# Altium schematic sheet BMS_FETs.SchDoc
size Tabloid; SheetNumber: 2; SheetTotal: 3
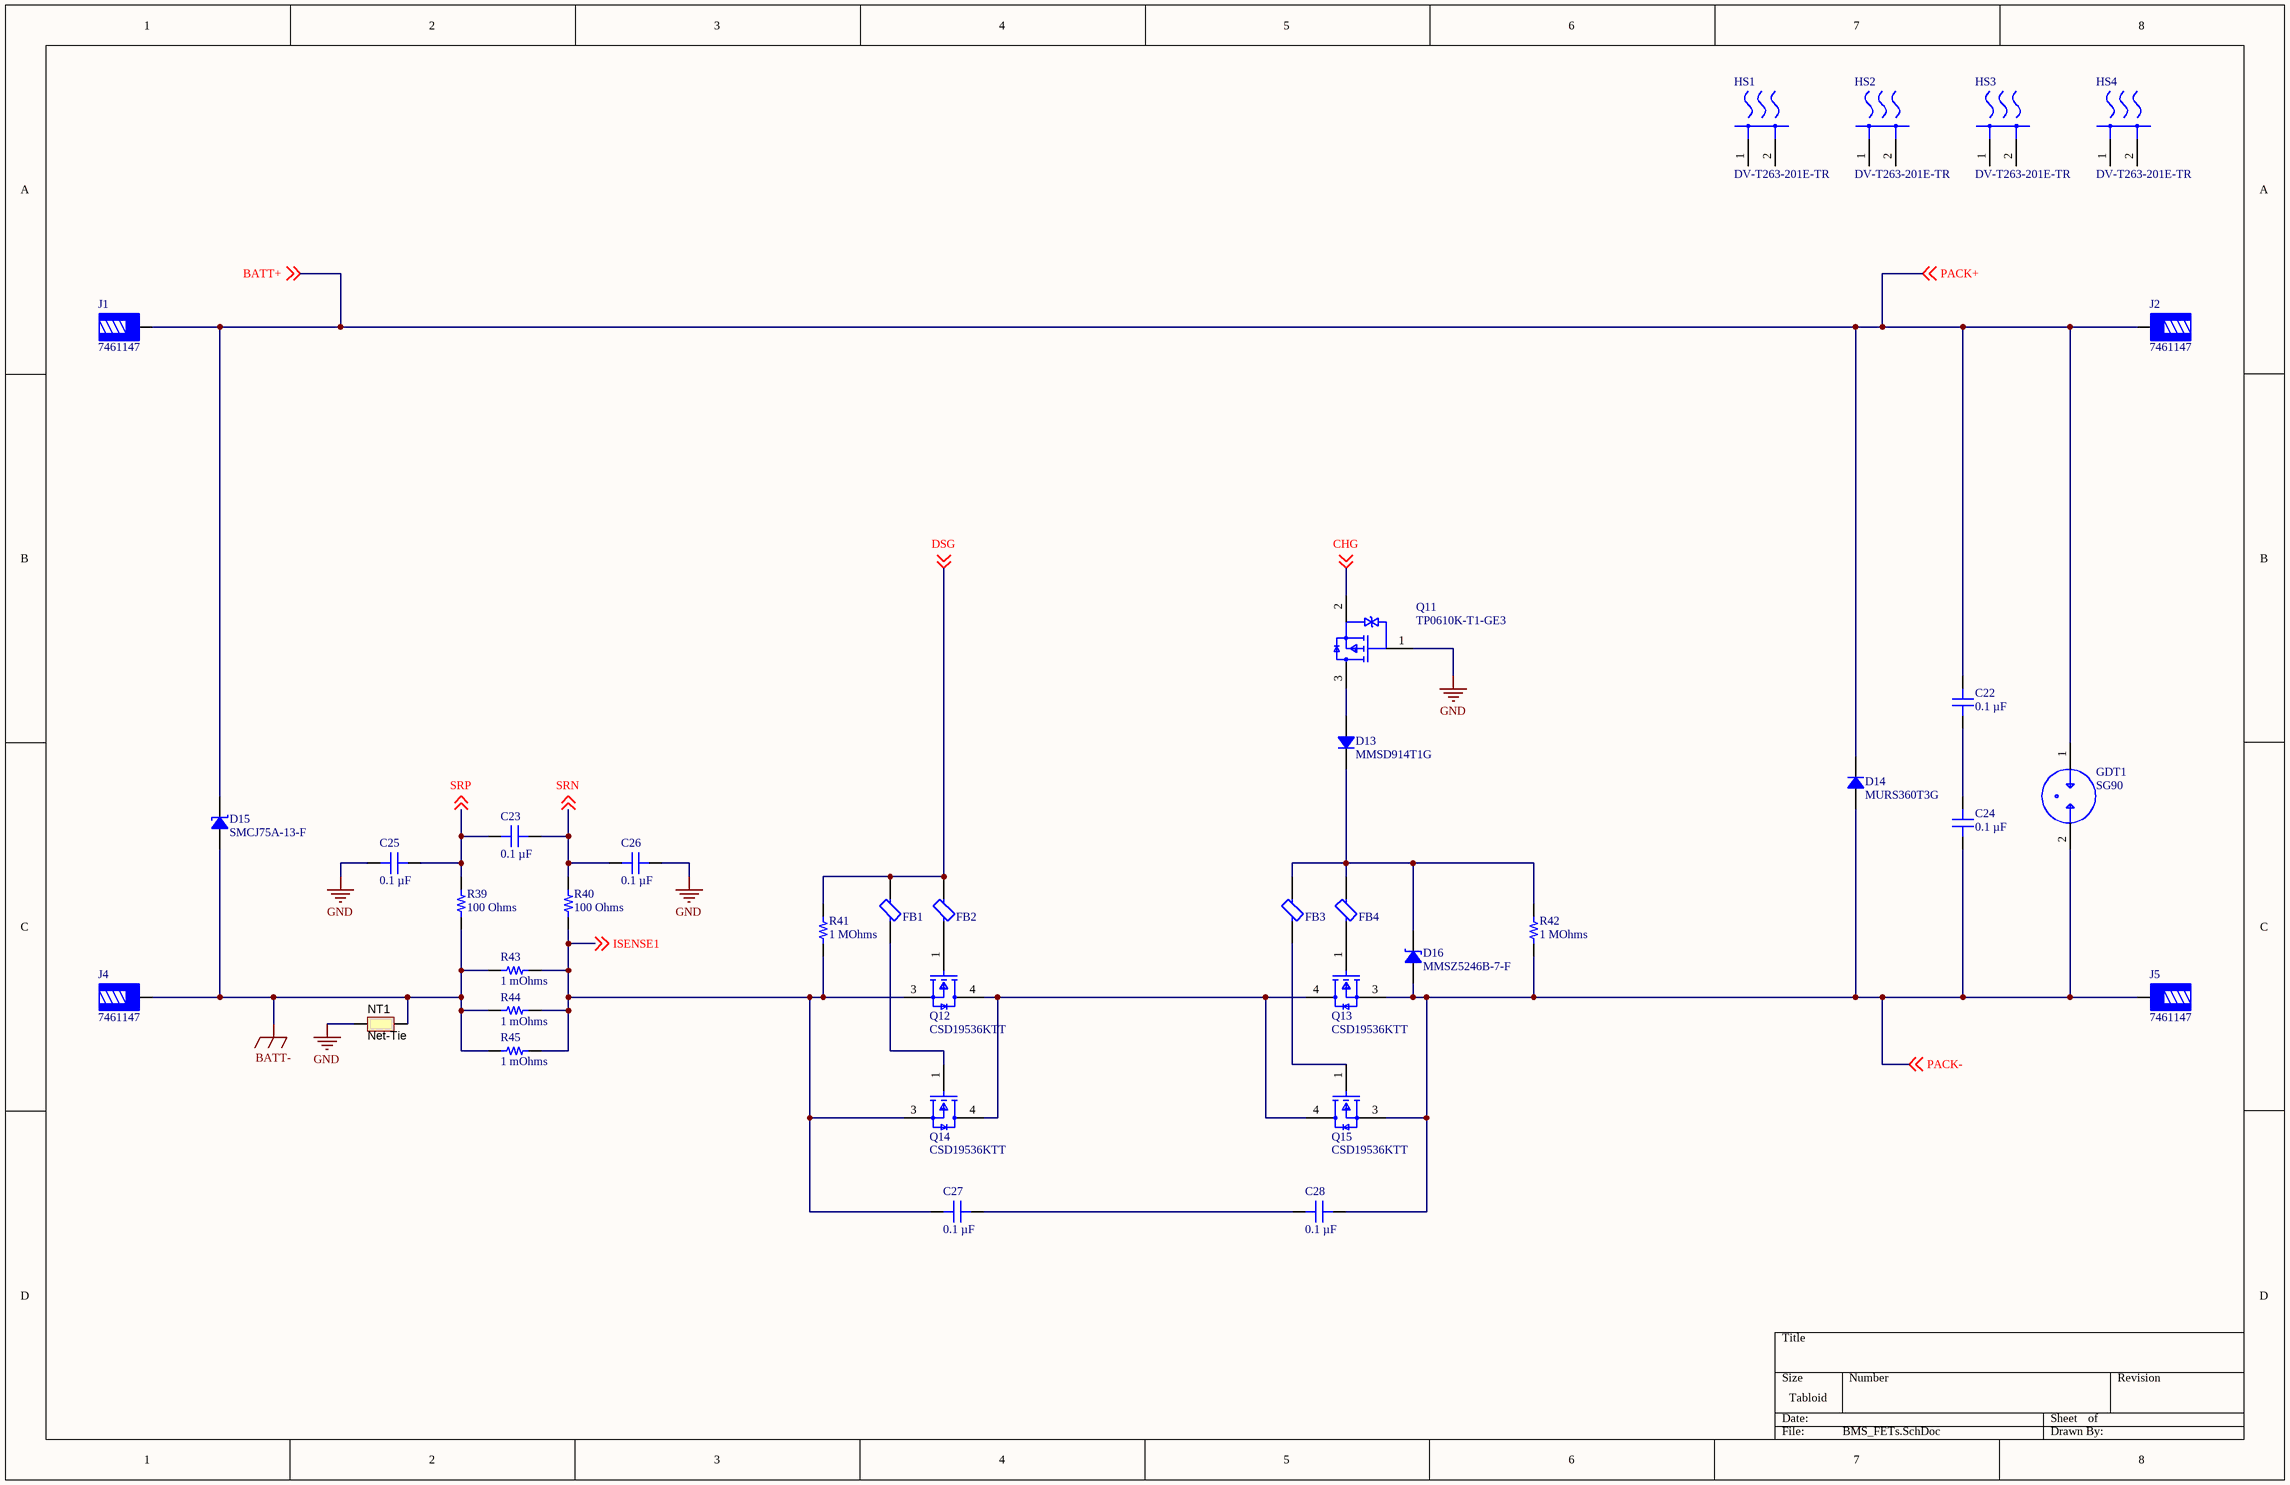
[diagram p0: BMS_FETs.SchDoc]

## Parts
C22  0.1 µF  [MURATA GRM188 0603_1608]
C23  0.1 µF  [CAP 0603_1608]
C24  0.1 µF  [MURATA GRM188 0603_1608]
C25  0.1 µF  [CAP 0603_1608]
C26  0.1 µF  [CAP 0603_1608]
C27  0.1 µF  [CAP 1206_3216 - 0.8MM]
C28  0.1 µF  [CAP 1206_3216 - 0.8MM]
D13  MMSD914T1G  [SOD-123]
D14  MURS360T3G  [DO214AB SMC]
D15  SMCJ75A-13-F  [DO214AB SMC]
D16  MMSZ5246B-7-F  [SOD-123]
FB1  BLM18SG221TN1D  [FP-BLM18-0_15-t0_5-IPC_C]  (value not drawn)
FB2  BLM18SG221TN1D  [FP-BLM18-0_15-t0_5-IPC_C]  (value not drawn)
FB3  BLM18SG221TN1D  [FP-BLM18-0_15-t0_5-IPC_C]  (value not drawn)
FB4  BLM18SG221TN1D  [FP-BLM18-0_15-t0_5-IPC_C]  (value not drawn)
GDT1  SG90  [FP-SG-MFG]
HS1  DV-T263-201E-TR  [FP-DV-T263-201E-TR-MFG]
HS2  DV-T263-201E-TR  [FP-DV-T263-201E-TR-MFG]
HS3  DV-T263-201E-TR  [FP-DV-T263-201E-TR-MFG]
HS4  DV-T263-201E-TR  [FP-DV-T263-201E-TR-MFG]
J1  7461147  [7461147_chemical surface]
J2  7461147  [7461147_chemical surface]
J4  7461147  [7461147_chemical surface]
J5  7461147  [7461147_chemical surface]
NT1  Net-Tie  [Net-Tie_10mil]  (net tie, no BOM)
Q11  TP0610K-T1-GE3  [FP-S-03946-IPC_C]
Q12  CSD19536KTT  [FP-CSD19536KTT-MFG]
Q13  CSD19536KTT  [FP-CSD19536KTT-MFG]
Q14  CSD19536KTT  [FP-CSD19536KTT-MFG]
Q15  CSD19536KTT  [FP-CSD19536KTT-MFG]
R39  100 Ohms  [RES 0805_2012]
R40  100 Ohms  [RES 0805_2012]
R41  1 MOhms  [RES 0603_1608]
R42  1 MOhms  [RES 0603_1608]
R43  1 mOhms  [RES 2512_6432]
R44  1 mOhms  [RES 2512_6432]
R45  1 mOhms  [RES 2512_6432]

## Nets
BATT-: D15.1 J4.1 NT1.2 R39.1 R43.1 R44.1 R45.1
GND: C25.1 C26.2 NT1.1 Q11.1(G)
BATT+: C22.2 D14.2 D15.2 GDT1.1 J1.1 J2.1 ; off-sheet BATT+, off-sheet PACK+  [also labelled PACK+]
CHG: Q11.2(S) ; off-sheet CHG
DSG: FB1.2 FB2.2 R41.2 ; off-sheet DSG
ISENSE1: C27.1 Q12.3(Source) Q14.3(Source) R40.1 R41.1 R43.2 R44.2 R45.2 ; off-sheet ISENSE1
PACK-: C24.1 C28.2 D14.1 D16.1 GDT1.2 J5.1 Q13.3(Source) Q15.3(Source) R42.1 ; off-sheet PACK-
SRN: C23.2 C26.1 R40.2 ; off-sheet SRN
SRP: C23.1 C25.2 R39.2 ; off-sheet SRP
NetC22_1: C22.1 C24.2
NetC27_2: C27.2 C28.1
NetD13_1: D13.1 Q11.3(D)
NetD13_2: D13.2 D16.2 FB3.2 FB4.2 R42.2
NetFB1_1: FB1.1 Q14.1(Gate)
NetFB2_1: FB2.1 Q12.1(Gate)
NetFB3_1: FB3.1 Q15.1(Gate)
NetFB4_1: FB4.1 Q13.1(Gate)
NetQ12_4: Q12.4(Drain) Q13.4(Drain) Q14.4(Drain) Q15.4(Drain)

Not connected (* = marked no-connect by the designer): HS1 1(MNT_1) 2(MNT_2); HS2 1(MNT_1) 2(MNT_2); HS3 1(MNT_1) 2(MNT_2); HS4 1(MNT_1) 2(MNT_2)

## Library data of the parts
C22 C24 = GRM188R72A104KA35D: CAP CER 0.1UF 100V X7R 0603; manufacturer: Murata Electronics; Tolerance: ±10%; Part Number: GRM188R72A104KA35D; Capacitance: 0.1 µF; Applications: General Purpose; componentlink1description: Datasheet; componentlink1url: https://www.murata.com/~/media/webrenewal/support/library/catalog/products/capacitor/mlcc/c02e.ashx?la=en-us; componentlink2description: DigiKey Link; componentlink2url: https://www.digikey.com/en/products/detail/murata-electronics/GRM188R72A104KA35D/702549; Device Package: 0603 (1608 Metric); lastupdated: 7/20/2024 12:23:21 AM; Lifecycle Status: Active; Minimum Order: 1; Mounting Type: Surface Mount, MLCC; Operating Temperature: -55°C ~ 125°C; Package / Case: 0603 (1608 Metric); packaging: TapeAndReel; partid: 9563; Part Status: Active; price: 0.02; series: GRM; Size / Dimension: 0.063" L x 0.031" W (1.60mm x 0.80mm); Supplier 1: DigiKey; Supplier Part Number 1: 490-3285-1-ND; Temperature Coefficient: X7R; Thickness (Max): 0.035" (0.90mm); value: 0.1 µF; Voltage - Rated: 100V
C23 C25 C26 = 885012206095: CAP CER 0.1UF 50V X7R 0603; manufacturer: Würth Elektronik; Tolerance: ±10%; Part Number: 885012206095; Capacitance: 0.1 µF; Applications: General Purpose; componentlink1description: Datasheet; componentlink1url: https://katalog.we-online.de/pbs/datasheet/885012206095.pdf; componentlink2description: DigiKey Link; componentlink2url: https://www.digikey.com/en/products/detail/würth-elektronik/885012206095/5453868; Device Package: 0603 (1608 Metric); lastupdated: 2/9/2024 8:10:15 PM; Lifecycle Status: Active; Minimum Order: 1; Mounting Type: Surface Mount, MLCC; Operating Temperature: -55°C ~ 125°C; Package / Case: 0603 (1608 Metric); packaging: TapeAndReel; partid: 14053; Part Status: Active; price: 0.02; series: WCAP-CSGP; Size / Dimension: 0.063" L x 0.031" W (1.60mm x 0.80mm); Supplier 1: DigiKey; Supplier Part Number 1: 732-8013-1-ND; Temperature Coefficient: X7R; Thickness (Max): 0.037" (0.95mm); value: 0.1 µF; Voltage - Rated: 50V
C27 C28 = 885342208002: CAP CER 0.1UF 200V X7R 1206; manufacturer: Würth Elektronik; Tolerance: ±10%; Part Number: 885342208002; Capacitance: 0.1 µF; Applications: General Purpose; componentlink1description: Datasheet; componentlink1url: https://katalog.we-online.de/pbs/datasheet/885342208002.pdf; componentlink2description: DigiKey Link; componentlink2url: https://www.digikey.com/en/products/detail/würth-elektronik/885342208002/9345893; Device Package: 1206 (3216 Metric); lastupdated: 6/4/2024 7:10:36 PM; Lifecycle Status: Active; Minimum Order: 1; Mounting Type: Surface Mount, MLCC; Operating Temperature: -55°C ~ 125°C; Package / Case: 1206 (3216 Metric); packaging: TapeAndReel; partid: 21012; Part Status: Active; price: 0.10; series: WCAP-CSMH; Size / Dimension: 0.126" L x 0.063" W (3.20mm x 1.60mm); Supplier 1: DigiKey; Supplier Part Number 1: 732-12081-1-ND; Temperature Coefficient: X7R; Thickness (Max): 0.071" (1.80mm); value: 0.1 µF; Voltage - Rated: 200V
D13 = MMSD914T1G: DIODE GEN PURP 100V 200MA SOD123; Manufacturer: ON Semiconductor; Current - Average Rectified (Io): 200mA (DC); Current - Reverse Leakage @ Vr: 5µA @ 75V; Diode Type: Standard; Reverse Recovery Time (trr): 4ns; Speed: Small Signal =< 200mA (Io), Any Speed; Voltage - Forward (Vf) (Max) @ If: 1V @ 10mA; Part Number: MMSD914T1G; ComponentLink1Description: Datasheet; ComponentLink1URL: http://www.onsemi.com/pub/Collateral/MMSD914T1-D.PDF; ComponentLink2Description: DigiKey Link; ComponentLink2URL: http://digikey.com/product-detail/en/on-semiconductor/MMSD914T1G/MMSD914T1GOSCT-ND/1139868; LastUpdated: 6/3/2024 7:54:45 PM; Lifecycle Status: Active; Minimum Order: 1; Mounting Type: Surface Mount; Operating Temperature - Junction: -55°C ~ 150°C; Package / Case: SOD-123; Packaging: TapeAndReel; PartId: 1020; Part Status: Active; Price: 0.03; Series: -; Supplier 1: DigiKey; Supplier Part Number 1: MMSD914T1GOSCT-ND; Supplier Device Package: SOD-123; Voltage - DC Reverse (Vr) (Max): 100V
D14 = MURS360T3G: DIODE GEN PURP 600V 3A SMC; Manufacturer: ON Semiconductor; Current - Reverse Leakage @ Vr: 10µA @ 600V; Diode Type: Standard; Reverse Recovery Time (trr): 75ns; Speed: Fast Recovery =< 500ns, > 200mA (Io); Voltage - Forward (Vf) (Max) @ If: 1.25V @ 3A; Part Number: MURS360T3G; ComponentLink1Description: Datasheet; ComponentLink1URL: http://www.onsemi.com/pub/Collateral/MURS320T3-D.PDF; ComponentLink2Description: DigiKey Link; ComponentLink2URL: http://digikey.com/product-detail/en/on-semiconductor/MURS360T3G/MURS360T3GOSCT-ND/964580; Current - Average Rectified (Io): 3A; LastUpdated: 6/3/2024 7:54:13 PM; Lifecycle Status: Active; Minimum Order: 1; Mounting Type: Surface Mount; Operating Temperature - Junction: -65°C ~ 175°C; Package / Case: DO-214AB, SMC; Packaging: TapeAndReel; PartId: 485; Part Status: Active; Price: 0.16; Series: -; Supplier 1: DigiKey; Supplier Part Number 1: MURS360T3GOSCT-ND; Supplier Device Package: SMC; Voltage - DC Reverse (Vr) (Max): 600V
D15 = SMCJ75A-13-F: TVS DIODE 75VWM 121VC SMC; Manufacturer: Diodes Incorporated; Current - Peak Pulse (10/1000µs): 12.4A; Power Line Protection: No; Power - Peak Pulse: 1500W (1.5kW); Type: Zener; Unidirectional Channels: 1; Voltage - Breakdown (Min): 83.3V; Voltage - Clamping (Max) @ Ipp: 121V; Voltage - Reverse Standoff (Typ): 75V; Part Number: SMCJ75A-13-F; Applications: General Purpose; ComponentLink1Description: Datasheet; ComponentLink1URL: https://www.diodes.com/assets/Datasheets/ds19003.pdf; ComponentLink2Description: DigiKey Link; ComponentLink2URL: https://www.digikey.com/en/products/detail/diodes-incorporated/SMCJ75A-13-F/765441; LastUpdated: 6/3/2024 7:57:03 PM; Lifecycle Status: Active; Minimum Order: 1; Mounting Type: Surface Mount; Operating Temperature: -55°C ~ 150°C (TJ); Package / Case: DO-214AB, SMC; Packaging: TapeAndReel; PartId: 6503; Part Status: Active; Price: 0.23; Series: -; Supplier 1: DigiKey; Supplier Part Number 1: SMCJ75A-FDICT-ND; Supplier Device Package: SMC
D16 = MMSZ5246B-7-F: DIODE ZENER 16V 500MW SOD123; Manufacturer: Diodes Incorporated; Current - Reverse Leakage @ Vr: 100 nA @ 12 V; Impedance (Max) (Zzt): 17 Ohms; Tolerance: ±5%; Voltage - Forward (Vf) (Max) @ If: 900 mV @ 10 mA; Part Number: MMSZ5246B-7-F; ComponentLink1Description: Datasheet; ComponentLink1URL: https://www.diodes.com/assets/Datasheets/ds18010.pdf; ComponentLink2Description: DigiKey Link; ComponentLink2URL: https://www.digikey.com/en/products/detail/diodes-incorporated/MMSZ5246B-7-F/717793; LastUpdated: 6/3/2024 7:55:47 PM; Lifecycle Status: Active; Minimum Order: 1; Mounting Type: Surface Mount; Operating Temperature: -65°C ~ 150°C; Package / Case: SOD-123; Packaging: TapeAndReel; PartId: 1896; Part Status: Active; Power - Max: 500 mW; Price: 0.02; Series: -; Supplier 1: DigiKey; Supplier Part Number 1: MMSZ5246B-FDICT-ND; Supplier Device Package: SOD-123; Voltage - Zener (Nom) (Vz): 16 V
FB1-FB4 = BLM18SG221TN1D: Chip Ferrite Bead, 0603, 220Ω @ 100MHz, 25%, 0.04Ω, 2.5A; Impedance: 220R; DC Resistance-Max: 40mR; Number of Circuits: 1; Test Frequency: 100MHz; Material: Ferrite; Lead Free: Lead Free; Width: 0.8mm; Max Current Rating: 2.5A; Termination: SMD/SMT; Depth: 0.95mm; Packaging: Tape and Reel; Case Code (Metric): 1608; DC Current: 2.5A; Weight: 7.1E-05oz; Min Operating Temperature: -55°C; DC Resistance (DCR): 40mR; Max Operating Temperature: 125°C; Core Material: Ferrite; Max DC Current: 2.5A; Case/Package: 0603; REACH SVHC: No SVHC; Height: 0.8mm; Number of Pins: 2; Tolerance: 25%; RoHS Compliant: Yes; Radiation Hardening: No; Current Rating: 2.5A; Number of Lines: 1; Series: BLM18S; Case Code (Imperial): 0603; Length: 1.6mm; Package Quantity: 1; Supplier 1: Mouser; Supplier Part Number 1: 81-BLM18SG221TN1D
GDT1 = SG90: GDT 90V 2KA 2 POLE SURFACE MOUNT; Fail Short: No; Number of Terminals/Pins: 2; REACH SVHC: No SVHC; Case Code (Imperial): 1812; Case/Package: 1812; Mount: Surface Mount; RoHS Compliant: Yes; Number of Pins: 2; Package Quantity: 2000; Length: 4.5mm; Number of Poles: 2; Min Operating Temperature: -40°C; Case Code (Metric): 4532; Max Operating Temperature: 90°C; Depth: 3.2mm; Termination: SMD/SMT; Packaging: Tape and Reel; Series: SG; Supplier 1: Digikey; Supplier Part Number 1: F4126CT-ND
HS1-HS4 = DV-T263-201E-TR: HEATSINK FOR TO-263; Natural Thermal Resistance: 8°C/W; Shape: Fins; Width: 12.7mm; Package Cooled: TO-263; Length: 25.9mm; Thermal Resistance @ Forced Air Flow (100 LFM): 8°C/W; Package Quantity: 1; Case/Package: TO-252; Material: Aluminium; Packaging: Tape and Reel; RoHS Compliant: Yes; Height: 12.1mm; Height Off Base: 0.48inch; Series: D; Mount: Solderable Feet; Supplier 1: Digikey; Supplier Part Number 1: DV-T263-201ECT-ND
J1 J2 J4 J5 = 7461147: 7461147 REDCUBE Power Element Poles, 180A, Press-Fit, M5 Internal Thread, Vertical, WP-BUFU; NexarPartId: 18187424; Number of Contacts: 16; Insulation: Non-Insulated; Contact Material: Copper; Contact Plating: Tin; Max Operating Temperature: 150°C; RoHS: Compliant; Mount: Through Hole; REACH SVHC: Unknown; Material: Brass; Width: 9mm; Packaging: Bulk; Length: 9mm; Termination: Press-Fit; Height: 10.5mm; Current Rating: 180A; Number of Pins: 16; Thread Size: M5; Min Operating Temperature: -55°C; Supplier 1: Digikey; Supplier Part Number 1: 732-3215-ND
NT1 = Net-Tie: Single point connection between nets.; SymbolCreator: codlsc; SymbolVersion: 2009-07-01; MountType: SMT; Publisher: Texas Instruments; LatestRevisionDate: 2012-11-28; LatestRevisionNote: Added Alternate PartNumber and Alternate Manufacturer parameters to appropriate components.
Q11 = TP0610K-T1-GE3: MOSFET P-CH 60V 185MA SOT23-3; Nominal Vgs: -1V; Polarity: P-CHANNEL; Power Dissipation: 350mW; Element Configuration: Single; Threshold Voltage: -2V; Turn-Off Delay Time: 35ns; Turn-On Delay Time: 20ns; Gate to Source Voltage (Vgs): 20V; Number of Elements: 1; Drain to Source Voltage (Vdss): -60V; Input Capacitance: 155pF; Rds On Max: 190mR; Continuous Drain Current (ID): -185mA; Drain to Source Resistance: 10R; Max Operating Temperature: 150°C; Height: 1.02mm; Weight: 0.050717oz; Radiation Hardening: No; Package Quantity: 1; Min Operating Temperature: -55°C; Packaging: Tape and Reel; Case/Package: SOT-23-3; Width: 1.4mm; Mount: Surface Mount; Series: TrenchFET®; Length: 3.04mm; Max Power Dissipation: 350mW; RoHS Compliant: Yes; Drain to Source Breakdown Voltage: -60V; Number of Pins: 3; Lead Free: Lead Free; Number of Channels: 1; Supplier 1: Mouser; Supplier Part Number 1: 781-TP0610K-T1-GE3
Q12-Q15 = CSD19536KTT: MOSFET N-CH 100V 200A TO263; Manufacturer: Texas Instruments; Gate Charge At Vgs: 118nC @ 10V; Threshold Vgs Max: 3.2V; Depletion Mode: False; Turn Off Delay Time: 32ns; Rthja Max: 62°C/W; Typ Forward Diode Voltage: 0.9V; Max Forward Diode Voltage: 1.1V; Reverse Recovery Time: 103ns; Number Of Channels: 1; Input Capacitace At Vds: 9250pF @ 50V; Reverse Recovery Charge: 548nC; Threshold Vgs Min: 2.1V; Drain To Source Resistance: 2mΩ; Transconductance: 329S; Power Dissipation: 375W; Gate To Source Voltage: 20V; Turn On Delay Time: 13ns; Max Junction Temp: +175°C; Standoff Height: 0mm; Pulse Drain Current: 400A; Digikey Description: MOSFET N-CH 100V 200A TO263; RoHS: TRUE; Lead Free: Yes; Drain To Source Voltage: 100V; Device Class L1: Discrete Semiconductors; Temperature Range Low: -55°C; Mouser Description: CSD19536KTT 100 V N-Channel NexFET? Power MOSFET 3-DDPAK/TO-263; Number Of N Channels: 1; Temperature Range High: +175°C; Temperature: -55°C to +175°C; Package: 0; ComponentLink2URL: http://www.ti.com/lit/ds/symlink/csd19536ktt.pdf; Height: 4.95mm; Automotive: No; Continuous Drain Current: 200A; Manufacturer Part Number: CSD19536KTT; Device Class L3: MOSFETs; Drain To Source Breakdown Voltage: 100V; ComponentLink2Description: Datasheet; Category: Trans; Device Class L2: Transistors; Octopart: https://octopart.com/csd19536ktt-texas+instruments-57155051; Supplier 1: Mouser; Supplier Part Number 1: 595-CSD19536KTTT
R39 R40 = CRCW0805100RFKEA: RES SMD 100 OHM 1% 1/8W 0805; Manufacturer: Vishay Dale; Power (Watts): 0.125W, 1/8W; Temperature Coefficient: ±100ppm/°C; Part Number: CRCW0805100RFKEA; Value: 100 Ohms; ComponentLink1Description: Datasheet; ComponentLink1URL: http://www.vishay.com/docs/20035/dcrcwe3.pdf; ComponentLink2Description: DigiKey Link; ComponentLink2URL: https://www.digikey.com/en/products/detail/vishay-dale/CRCW0805100RFKEA/1175523; Composition: Thick Film; Device Package: 0805 (2012 Metric); Features: Automotive AEC-Q200; Height - Seated (Max): 0.020" (0.50mm); LastUpdated: 2/8/2024 9:02:37 PM; Lifecycle Status: Active; Minimum Order: 1; Number of Terminations: 2; Operating Temperature: -55°C ~ 155°C; Package / Case: 0805 (2012 Metric); Packaging: TapeAndReel; PartId: 28106; Part Status: Active; Price: 0.01; Ratings: AEC-Q200; Resistance: 100 Ohms; Series: CRCW; Size / Dimension: 0.079" L x 0.049" W (2.00mm x 1.25mm); Supplier 1: DigiKey; Supplier Part Number 1: 541-100CCT-ND; Supplier Device Package: 0805; Tolerance: ±1%
R41 R42 = RMCF0603JT1M00: RES 1M OHM 5% 1/10W 0603; Manufacturer: Stackpole Electronics Inc; Power (Watts): 0.1W, 1/10W; Temperature Coefficient: ±200ppm/°C; Part Number: RMCF0603JT1M00; Value: 1 MOhms; ComponentLink1Description: Datasheet; ComponentLink1URL: https://www.seielect.com/catalog/sei-rmcf_rmcp.pdf; ComponentLink2Description: DigiKey Link; ComponentLink2URL: https://www.digikey.com/en/products/detail/stackpole-electronics-inc/RMCF0603JT1M00/1758066; Composition: Thick Film; Device Package: 0603 (1608 Metric); Features: Automotive AEC-Q200; Height - Seated (Max): 0.022" (0.55mm); LastUpdated: 2/9/2024 8:43:33 PM; Lifecycle Status: Active; Minimum Order: 1; Number of Terminations: 2; Operating Temperature: -55°C ~ 155°C; Package / Case: 0603 (1608 Metric); Packaging: CutTape; PartId: 5847; Part Status: Active; Price: 0.01; Ratings: AEC-Q200; Resistance: 1 MOhms; Series: RMCF; Size / Dimension: 0.061" L x 0.031" W (1.55mm x 0.80mm); Supplier 1: DigiKey; Supplier Part Number 1: RMCF0603JT1M00CT-ND; Supplier Device Package: 0603; Tolerance: ±5%
R43-R45 = WSLF25121L000FEA: RES 0.001 OHM 1% 5W 2512; manufacturer: Vishay Dale; Temperature Coefficient: ±170ppm/°C; Part Number: WSLF25121L000FEA; componentlink1description: Datasheet; componentlink1url: http://www.vishay.com/docs/30193/wslf.pdf; componentlink2description: DigiKey Link; componentlink2url: http://digikey.com/product-detail/en/vishay-dale/WSLF25121L000FEA/541-3125-1-ND/6194698; Composition: Metal Element; Device Package: 2512 (6432 Metric); Features: Automotive AEC-Q200, Current Sense, Moisture Resistant, Pulse Withstanding; Height - Seated (Max): 0.034" (0.86mm); lastupdated: 5/23/2022 1:49:31 PM; Lifecycle Status: Active; Minimum Order: 1; Number of Terminations: 2; Operating Temperature: -65°C ~ 170°C; Package / Case: 2512 (6432 Metric); packaging: TapeAndReel; Part Status: Active; Power (Watts): 5W; price: 0.22; Ratings: AEC-Q200; Resistance: 1 mOhms; series: WSLF; Size / Dimension: 0.250" L x 0.119" W (6.35mm x 3.02mm); Supplier 1: DigiKey; Supplier Part Number 1: 541-3125-1-ND; Supplier Device Package: 2512; Tolerance: ±1%; value: 1 mOhms